# Altium schematic sheet Группа 1.SchDoc
size 420 x 297 mm
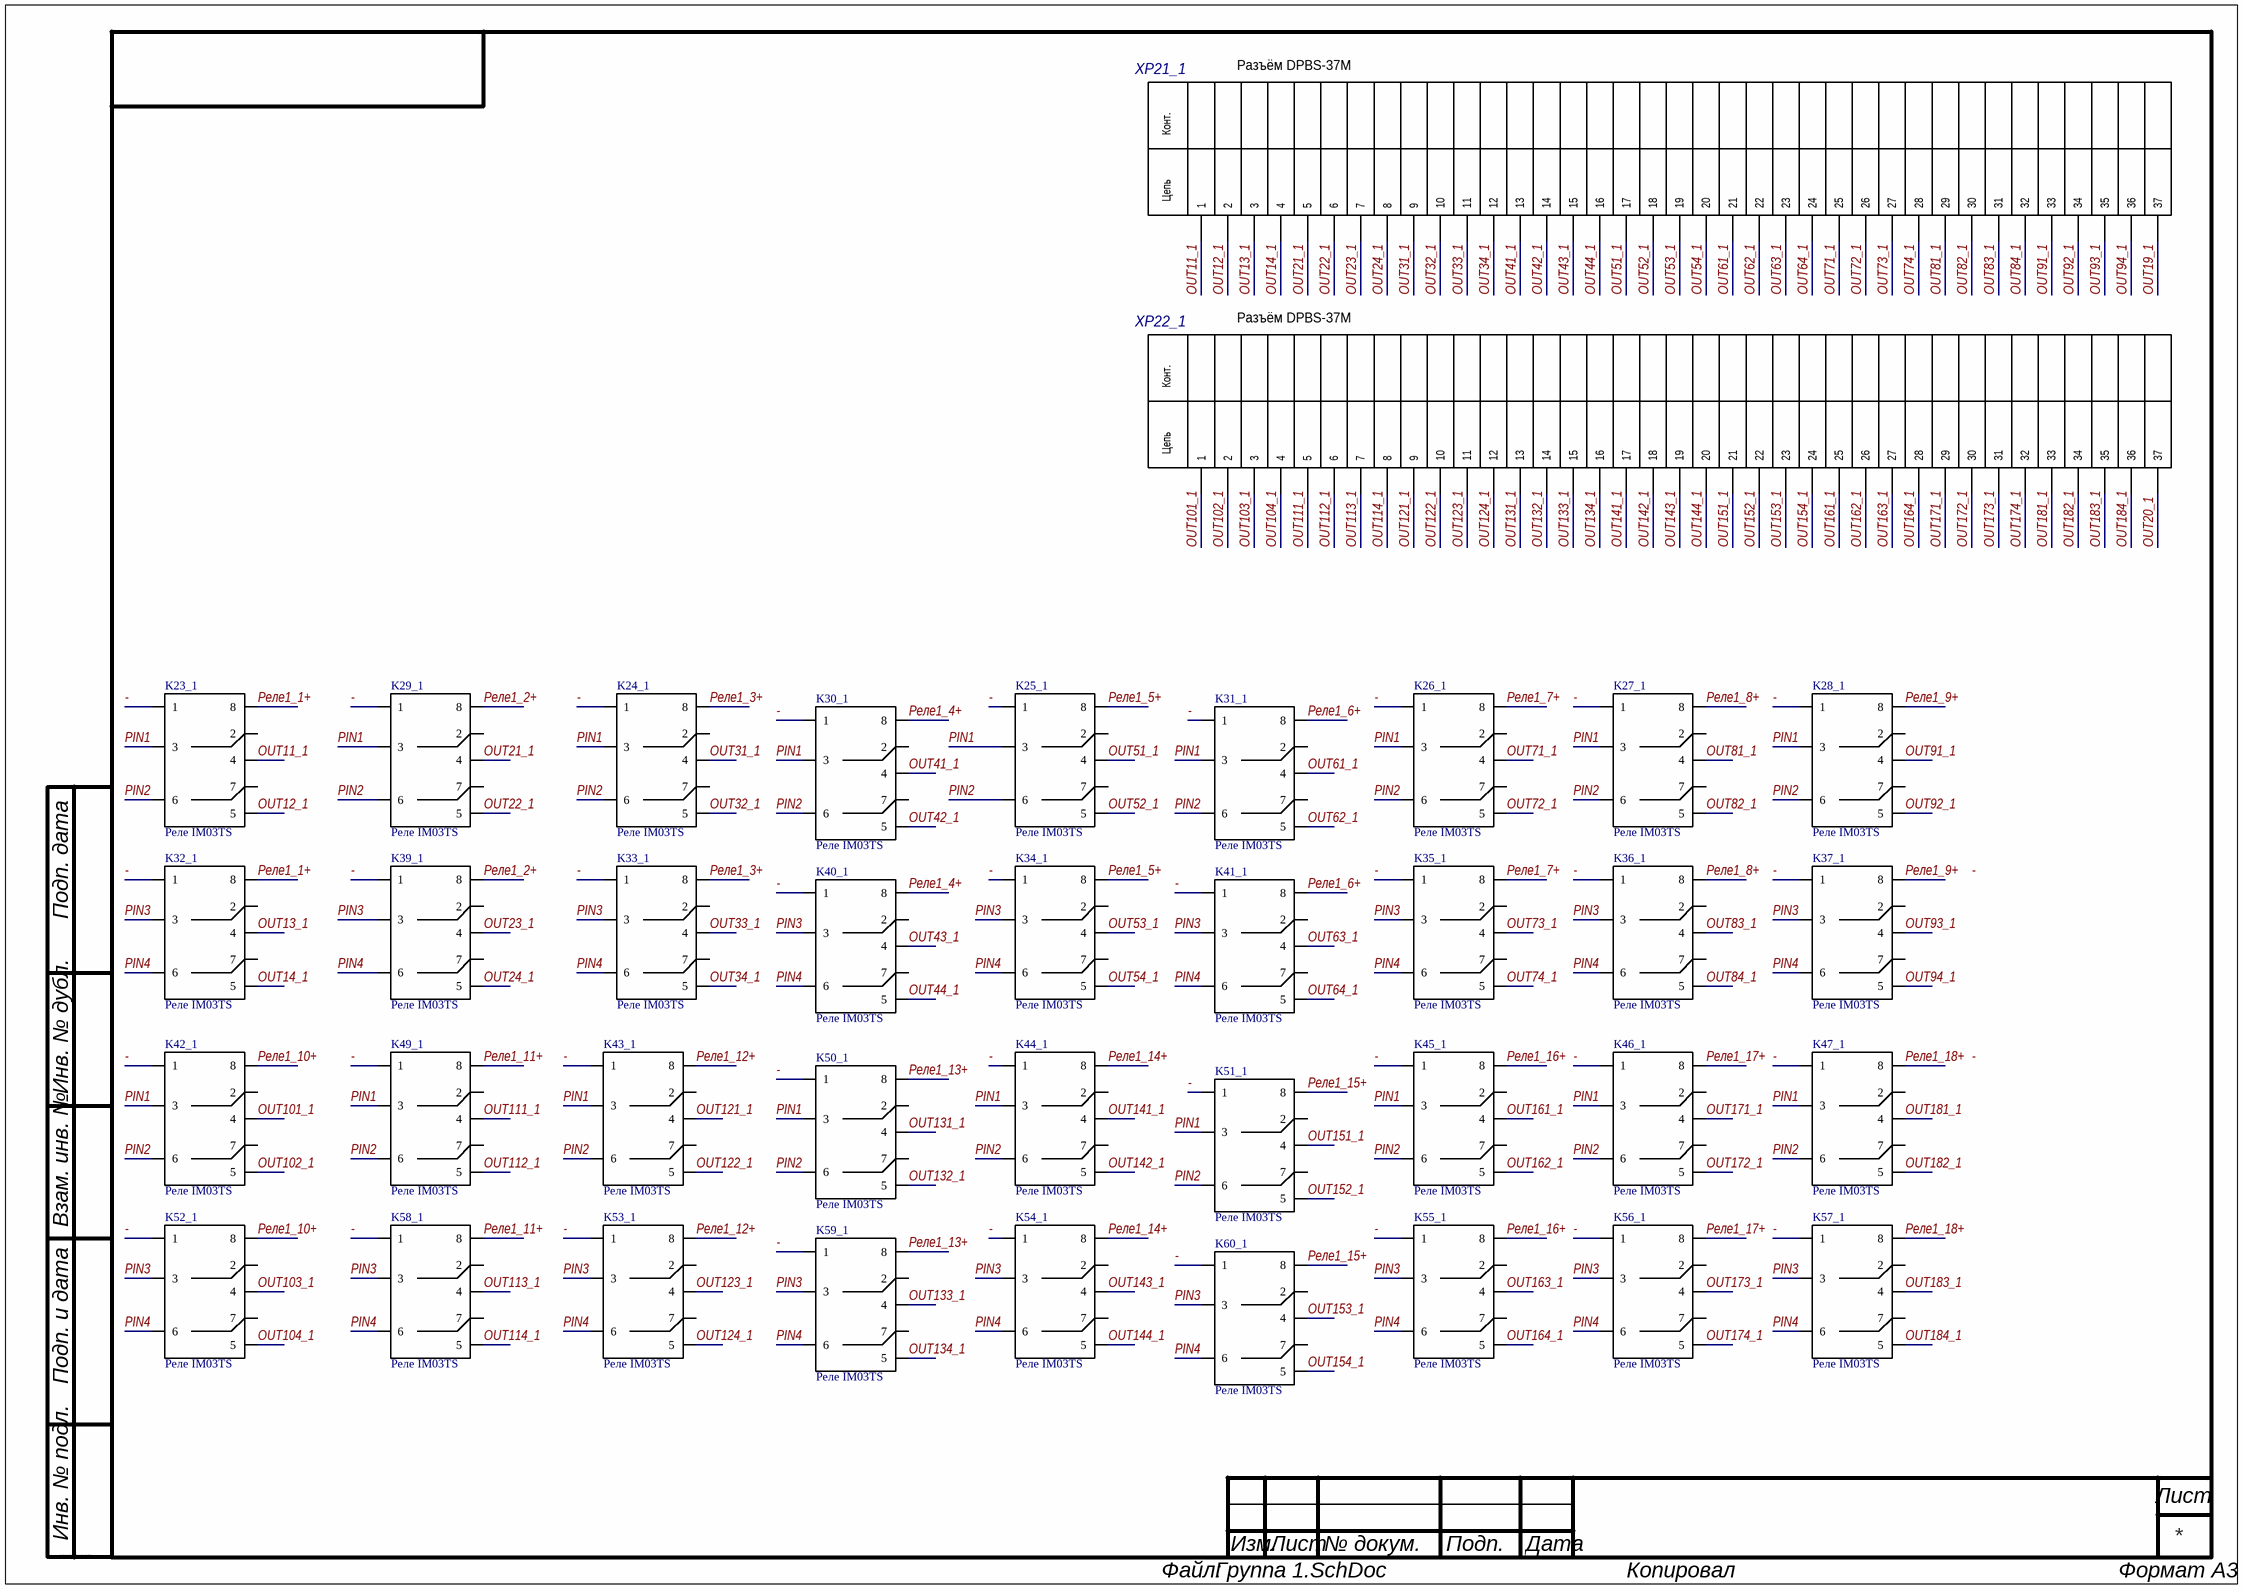
[diagram p0: Группа 1.SchDoc]

## Parts
K23_1  Реле IM03TS  [IM03TS]
K24_1  Реле IM03TS  [IM03TS]
K25_1  Реле IM03TS  [IM03TS]
K26_1  Реле IM03TS  [IM03TS]
K27_1  Реле IM03TS  [IM03TS]
K28_1  Реле IM03TS  [IM03TS]
K29_1  Реле IM03TS  [IM03TS]
K30_1  Реле IM03TS  [IM03TS]
K31_1  Реле IM03TS  [IM03TS]
K32_1  Реле IM03TS  [IM03TS]
K33_1  Реле IM03TS  [IM03TS]
K34_1  Реле IM03TS  [IM03TS]
K35_1  Реле IM03TS  [IM03TS]
K36_1  Реле IM03TS  [IM03TS]
K37_1  Реле IM03TS  [IM03TS]
K39_1  Реле IM03TS  [IM03TS]
K40_1  Реле IM03TS  [IM03TS]
K41_1  Реле IM03TS  [IM03TS]
K42_1  Реле IM03TS  [IM03TS]
K43_1  Реле IM03TS  [IM03TS]
K44_1  Реле IM03TS  [IM03TS]
K45_1  Реле IM03TS  [IM03TS]
K46_1  Реле IM03TS  [IM03TS]
K47_1  Реле IM03TS  [IM03TS]
K49_1  Реле IM03TS  [IM03TS]
K50_1  Реле IM03TS  [IM03TS]
K51_1  Реле IM03TS  [IM03TS]
K52_1  Реле IM03TS  [IM03TS]
K53_1  Реле IM03TS  [IM03TS]
K54_1  Реле IM03TS  [IM03TS]
K55_1  Реле IM03TS  [IM03TS]
K56_1  Реле IM03TS  [IM03TS]
K57_1  Реле IM03TS  [IM03TS]
K58_1  Реле IM03TS  [IM03TS]
K59_1  Реле IM03TS  [IM03TS]
K60_1  Реле IM03TS  [IM03TS]
XP21_1  Разъём DPBS-37M  [DPBS-37M]
XP22_1  Разъём DPBS-37M  [DPBS-37M]

## Nets
-: K23_1.1 K24_1.1 K25_1.1 K26_1.1 K27_1.1 K28_1.1 K29_1.1 K30_1.1 K31_1.1 K32_1.1 K33_1.1 K34_1.1 K35_1.1 K36_1.1 K37_1.1 K39_1.1 K40_1.1 K41_1.1 K42_1.1 K43_1.1 K44_1.1 K45_1.1 K46_1.1 K47_1.1 K49_1.1 K50_1.1 K51_1.1 K52_1.1 K53_1.1 K54_1.1 K55_1.1 K56_1.1 K57_1.1 K58_1.1 K59_1.1 K60_1.1
OUT11_1: K23_1.4 XP21_1.1
OUT12_1: K23_1.5 XP21_1.2
OUT13_1: K32_1.4 XP21_1.3
OUT14_1: K32_1.5 XP21_1.4
OUT19_1: XP21_1.37
OUT20_1: XP22_1.37
OUT21_1: K29_1.4 XP21_1.5
OUT22_1: K29_1.5 XP21_1.6
OUT23_1: K39_1.4 XP21_1.7
OUT24_1: K39_1.5 XP21_1.8
OUT31_1: K24_1.4 XP21_1.9
OUT32_1: K24_1.5 XP21_1.10
OUT33_1: K33_1.4 XP21_1.11
OUT34_1: K33_1.5 XP21_1.12
OUT41_1: K30_1.4 XP21_1.13
OUT42_1: K30_1.5 XP21_1.14
OUT43_1: K40_1.4 XP21_1.15
OUT44_1: K40_1.5 XP21_1.16
OUT51_1: K25_1.4 XP21_1.17
OUT52_1: K25_1.5 XP21_1.18
OUT53_1: K34_1.4 XP21_1.19
OUT54_1: K34_1.5 XP21_1.20
OUT61_1: K31_1.4 XP21_1.21
OUT62_1: K31_1.5 XP21_1.22
OUT63_1: K41_1.4 XP21_1.23
OUT64_1: K41_1.5 XP21_1.24
OUT71_1: K26_1.4 XP21_1.25
OUT72_1: K26_1.5 XP21_1.26
OUT73_1: K35_1.4 XP21_1.27
OUT74_1: K35_1.5 XP21_1.28
OUT81_1: K27_1.4 XP21_1.29
OUT82_1: K27_1.5 XP21_1.30
OUT83_1: K36_1.4 XP21_1.31
OUT84_1: K36_1.5 XP21_1.32
OUT91_1: K28_1.4 XP21_1.33
OUT92_1: K28_1.5 XP21_1.34
OUT93_1: K37_1.4 XP21_1.35
OUT94_1: K37_1.5 XP21_1.36
OUT101_1: K42_1.4 XP22_1.1
OUT102_1: K42_1.5 XP22_1.2
OUT103_1: K52_1.4 XP22_1.3
OUT104_1: K52_1.5 XP22_1.4
OUT111_1: K49_1.4 XP22_1.5
OUT112_1: K49_1.5 XP22_1.6
OUT113_1: K58_1.4 XP22_1.7
OUT114_1: K58_1.5 XP22_1.8
OUT121_1: K43_1.4 XP22_1.9
OUT122_1: K43_1.5 XP22_1.10
OUT123_1: K53_1.4 XP22_1.11
OUT124_1: K53_1.5 XP22_1.12
OUT131_1: K50_1.4 XP22_1.13
OUT132_1: K50_1.5 XP22_1.14
OUT133_1: K59_1.4 XP22_1.15
OUT134_1: K59_1.5 XP22_1.16
OUT141_1: K44_1.4 XP22_1.17
OUT142_1: K44_1.5 XP22_1.18
OUT143_1: K54_1.4 XP22_1.19
OUT144_1: K54_1.5 XP22_1.20
OUT151_1: K51_1.4 XP22_1.21
OUT152_1: K51_1.5 XP22_1.22
OUT153_1: K60_1.4 XP22_1.23
OUT154_1: K60_1.5 XP22_1.24
OUT161_1: K45_1.4 XP22_1.25
OUT162_1: K45_1.5 XP22_1.26
OUT163_1: K55_1.4 XP22_1.27
OUT164_1: K55_1.5 XP22_1.28
OUT171_1: K46_1.4 XP22_1.29
OUT172_1: K46_1.5 XP22_1.30
OUT173_1: K56_1.4 XP22_1.31
OUT174_1: K56_1.5 XP22_1.32
OUT181_1: K47_1.4 XP22_1.33
OUT182_1: K47_1.5 XP22_1.34
OUT183_1: K57_1.4 XP22_1.35
OUT184_1: K57_1.5 XP22_1.36
PIN1: K23_1.3 K24_1.3 K25_1.3 K26_1.3 K27_1.3 K28_1.3 K29_1.3 K30_1.3 K31_1.3 K42_1.3 K43_1.3 K44_1.3 K45_1.3 K46_1.3 K47_1.3 K49_1.3 K50_1.3 K51_1.3
PIN2: K23_1.6 K24_1.6 K25_1.6 K26_1.6 K27_1.6 K28_1.6 K29_1.6 K30_1.6 K31_1.6 K42_1.6 K43_1.6 K44_1.6 K45_1.6 K46_1.6 K47_1.6 K49_1.6 K50_1.6 K51_1.6
PIN3: K32_1.3 K33_1.3 K34_1.3 K35_1.3 K36_1.3 K37_1.3 K39_1.3 K40_1.3 K41_1.3 K52_1.3 K53_1.3 K54_1.3 K55_1.3 K56_1.3 K57_1.3 K58_1.3 K59_1.3 K60_1.3
PIN4: K32_1.6 K33_1.6 K34_1.6 K35_1.6 K36_1.6 K37_1.6 K39_1.6 K40_1.6 K41_1.6 K52_1.6 K53_1.6 K54_1.6 K55_1.6 K56_1.6 K57_1.6 K58_1.6 K59_1.6 K60_1.6
Реле1_1+: K23_1.8 K32_1.8
Реле1_2+: K29_1.8 K39_1.8
Реле1_3+: K24_1.8 K33_1.8
Реле1_4+: K30_1.8 K40_1.8
Реле1_5+: K25_1.8 K34_1.8
Реле1_6+: K31_1.8 K41_1.8
Реле1_7+: K26_1.8 K35_1.8
Реле1_8+: K27_1.8 K36_1.8
Реле1_9+: K28_1.8 K37_1.8
Реле1_10+: K42_1.8 K52_1.8
Реле1_11+: K49_1.8 K58_1.8
Реле1_12+: K43_1.8 K53_1.8
Реле1_13+: K50_1.8 K59_1.8
Реле1_14+: K44_1.8 K54_1.8
Реле1_15+: K51_1.8 K60_1.8
Реле1_16+: K45_1.8 K55_1.8
Реле1_17+: K46_1.8 K56_1.8
Реле1_18+: K47_1.8 K57_1.8

Not connected (* = marked no-connect by the designer): K23_1 2 7; K24_1 2 7; K25_1 2 7; K26_1 2 7; K27_1 2 7; K28_1 2 7; K29_1 2 7; K30_1 2 7; K31_1 2 7; K32_1 2 7; K33_1 2 7; K34_1 2 7; K35_1 2 7; K36_1 2 7; K37_1 2 7; K39_1 2 7; K40_1 2 7; K41_1 2 7; K42_1 2 7; K43_1 2 7; K44_1 2 7; K45_1 2 7; K46_1 2 7; K47_1 2 7; K49_1 2 7; K50_1 2 7; K51_1 2 7; K52_1 2 7; K53_1 2 7; K54_1 2 7; K55_1 2 7; K56_1 2 7; K57_1 2 7; K58_1 2 7; K59_1 2 7; K60_1 2 7

## Notes on the sheet
- Labels drawn without touching a wire or pin: -
- Подп. дата
- Инв. № дубл.
- Взам. инв. №
- Подп. и дата
- Инв. № подл.
- Изм.
- Лист
- № докум.
- Подп.
- Дата
- ALTIUM GOSTBOM2.0 KEV
- Файл:
- Копировал
- Формат А3
- (in symbol DPBS-37M) Конт.; Цепь

## Library data of the parts
K23_1 K24_1 K25_1 K26_1 K27_1 K28_1 K29_1 K30_1 K31_1 K32_1 K33_1 K34_1 K35_1 K36_1 K37_1 K39_1 K40_1 K41_1 K42_1 K43_1 K44_1 K45_1 K46_1 K47_1 K49_1 K50_1 K51_1 K52_1 K53_1 K54_1 K55_1 K56_1 K57_1 K58_1 K59_1 K60_1 = IM03TS: Реле
XP21_1 XP22_1 = DPBS-37M